# Altium schematic sheet RS485.SchDoc
size A4
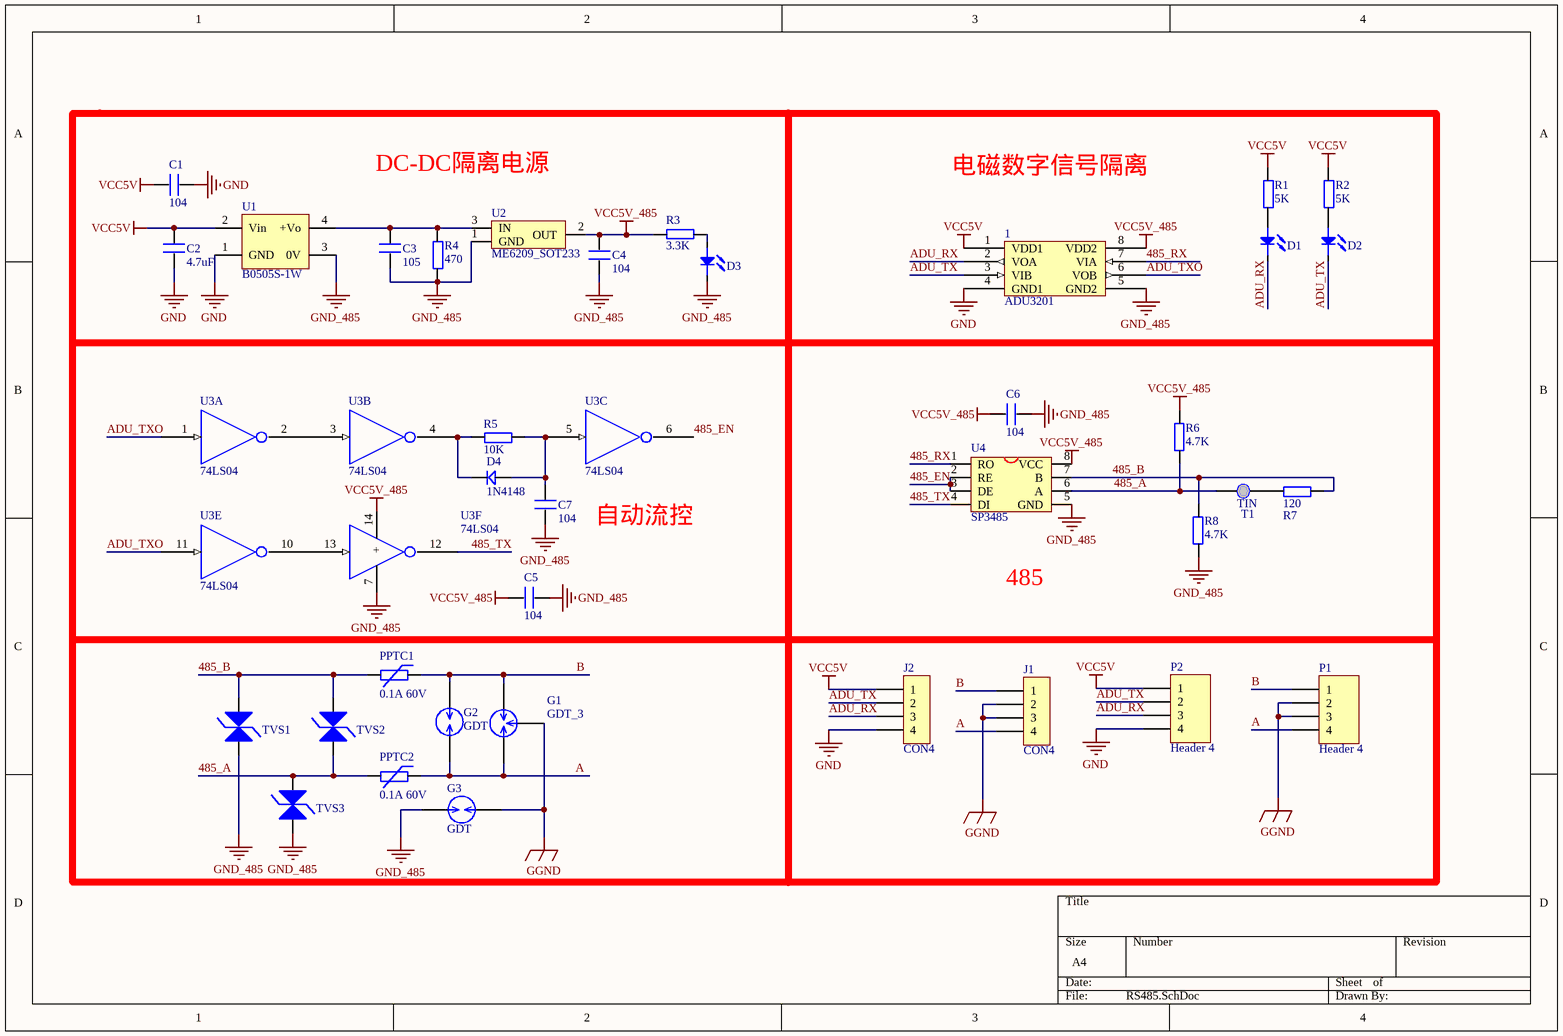
[diagram p0: RS485.SchDoc]

## Parts
1  ADU3201  [SO-8]
C1  104  [C_0805]
C2  4.7uF  [C_0805]
C3  105  [C_0805]
C4  104  [C_0805]
C5  104  [C_0805]
C6  104  [C_0805]
C7  104  [C_0805]
D1  LED  [0805-LED-RED]  (value not drawn)
D2  LED  [0805-LED-RED]  (value not drawn)
D3  LED  [0805-LED-RED]  (value not drawn)
D4  1N4148  [DIODE-1206]
G1  GDT_3  [GDT3B]
G2  GDT  [1812_C]
G3  GDT  [1812_C]
J1  CON4  [Conect4_3.81E]
J2  CON4  [Conect4_3.81E]
P1  Header 4  [HDR1X4]
P2  Header 4  [HDR1X4]
PPTC1  0.1A 60V  [1812F]
PPTC2  0.1A 60V  [1812F]
R1  5K  [0805]
R2  5K  [0805]
R3  3.3K  [0805]
R4  470  [0805]
R5  10K  [0805]
R6  4.7K  [0805]
R7  120  [0805]
R8  4.7K  [0805]
T1  TIN  [TIN]
TVS1  TVS_2  [DIODE-SMA]  (value not drawn)
TVS2  TVS_2  [DIODE-SMA]  (value not drawn)
TVS3  TVS_2  [DIODE-SMA]  (value not drawn)
U1  B0505S-1W  [B0505S-1W]
U2  ME6209_SOT233  [SOT-23 - duplicate1]
U3  74LS04  [SOP-14N]  (parts A,B,C,E,F of 6)
U4  SP3485  [SOP-8]

## Nets
GGND: G1.2 G3.2 J1.2 J1.3 P1.2 P1.3
GND: 1.4(GND1) C1.1 C2.1 J2.4 P2.4 U1.1(GND)
GND_485: 1.5(GND2) C3.1 C4.1 C5.1 C6.1 C7.2 D3.K G3.1 R4.1 R8.2 TVS1.1(A) TVS3.2(K) U1.3(0V) U2.1(GND) U3.7 U4.5(GND)
VCC5V: 1.1(VDD1) C1.2 C2.2 J2.1 P2.1 R1.2 R2.2 U1.2(Vin)
VCC5V_485: 1.8(VDD2) C4.2 C5.2 C6.2 R3.2 R6.1 U2.2(OUT) U3.14(+) U4.8(VCC)
485_A: PPTC2.1 R6.2 T1.2 TVS2.1(A) TVS3.1(A) U4.6(A)
485_B: PPTC1.1 R7.2 R8.1 TVS1.2(K) TVS2.2(K) U4.7(B)
485_EN: U3.6 U4.2(RE) U4.3(DE)
485_RX: 1.7(VIA) U4.1(RO)
485_TX: U3.12 U4.4(DI)
A: G1.3 G2.1 J1.4 P1.4 PPTC2.2
ADU_RX: 1.2(VOA) D1.K J2.3 P2.3
ADU_TX: 1.3(VIB) D2.K J2.2 P2.2
ADU_TXO: 1.6(VOB) U3.1 U3.11
B: G1.1 G2.2 J1.1 P1.1 PPTC1.2
NetC3_2: C3.2 R4.2 U1.4(+Vo) U2.3(IN)
NetC7_1: C7.1 D4.1 R5.2 U3.5
NetD1_A: D1.A R1.1
NetD2_A: D2.A R2.1
NetD3_A: D3.A R3.1
NetD4_2: D4.2 R5.1 U3.4
NetR7_1: R7.1 T1.1
NetU3_2: U3.2 U3.3
NetU3_10: U3.10 U3.13

## Notes on the sheet
- DC-DC隔离电源
- 电磁数字信号隔离
- 自动流控
- 485

## Library data of the parts
C1-C7 = C
D4 = D
G1 = GDT_3: 放电器
G2 G3 = GDT: 放电器
P1 P2 = Header 4: Header, 4-Pin; LatestRevisionDate: 17-Jul-2002; LatestRevisionNote: Re-released for DXP Platform.; Publisher: Altium Limited
PPTC1 PPTC2 = PPTC
R1-R8 = R
TVS1-TVS3 = TVS_2: TVS双向二极管; Published: 8-Jun-2000; LatestRevisionDate: 17-Jul-2002; LatestRevisionNote: Re-released for DXP Platform.; PackageDocument: Sep-1996; PackageReference: SMC; Publisher: Altium Limited; Code_JEDEC: DO-214-AB
U1 = B0505S-1W: DC/DC隔离电源（Mornsun）
U2 = ME6209
U3 = 74LS04: 非门
U4 = MAX3485